# Altium schematic sheet Cover Page.SchDoc: Cover Page
size Letter; Organization: IT Logic; Address1: 5753 Highway 85 N; Address2: Crestview, FL 32536; Address3: United States; DocumentNumber: 1; SheetNumber: 1; SheetTotal: 6; Email: pcb-design@itlogic.cloud
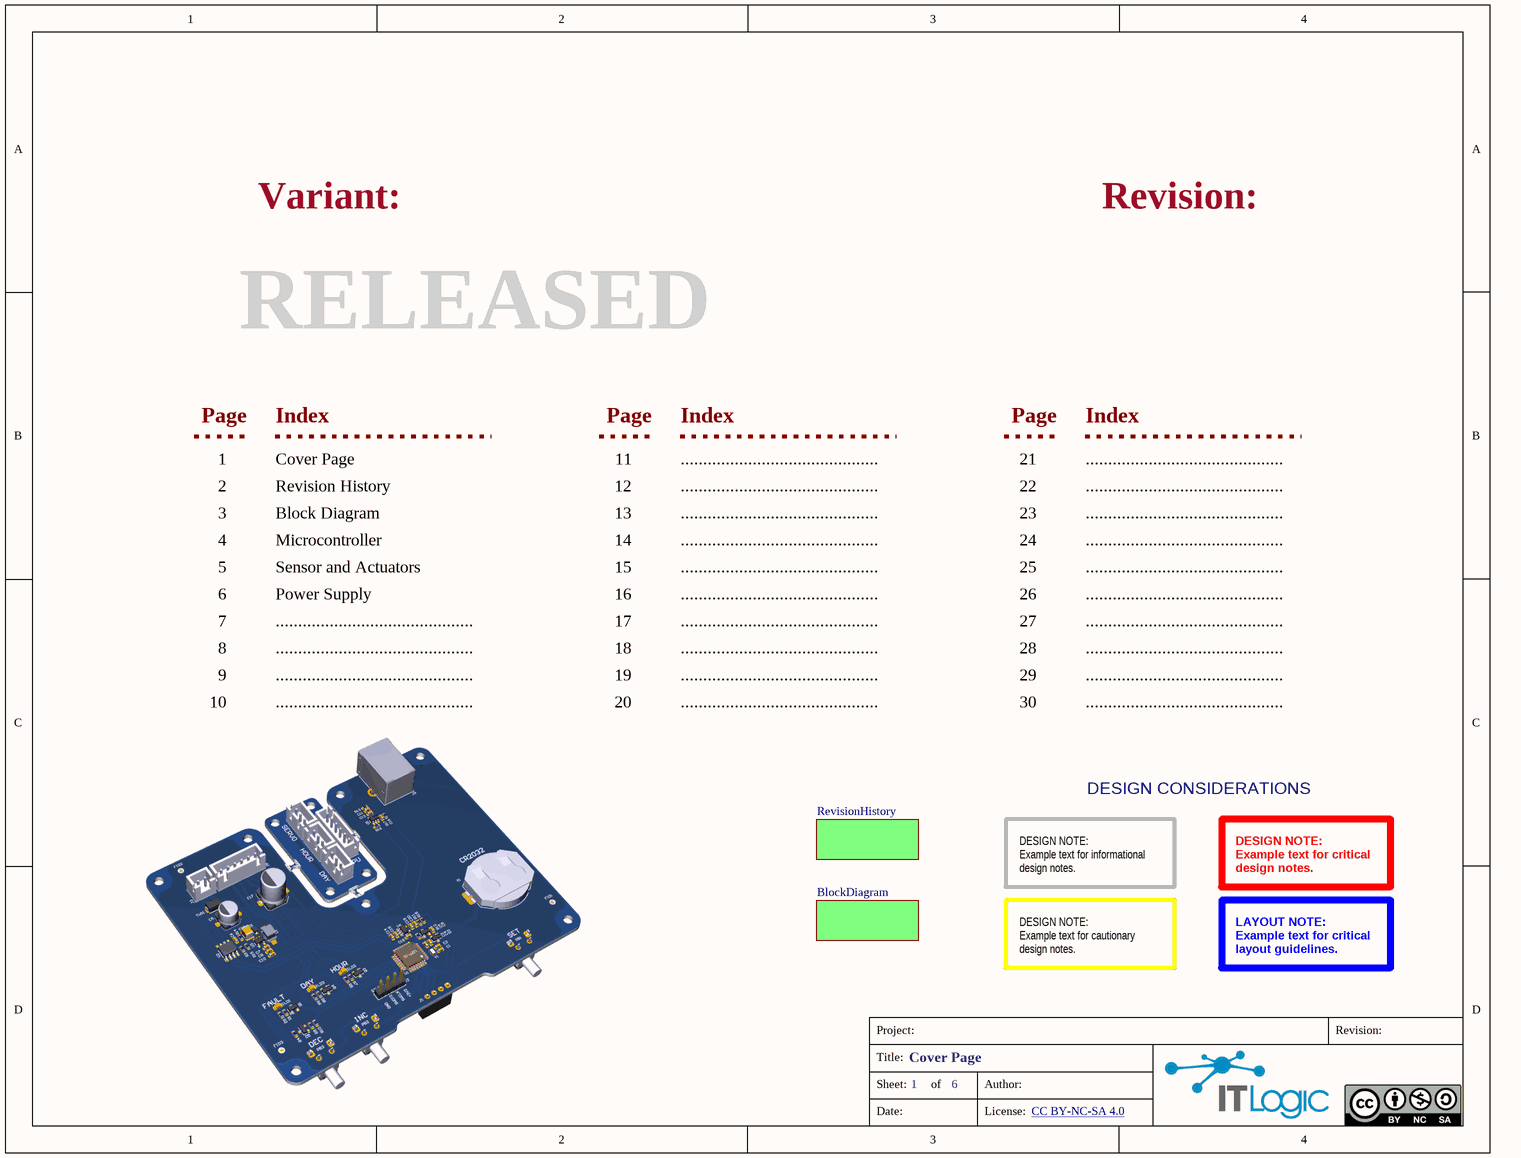
[diagram p0: Cover Page.SchDoc]

## Sub-sheets
BlockDiagram = Block Diagram.SchDoc: no entries
RevisionHistory = Revision History.SchDoc: no entries

## Notes on the sheet
- Variant:
- Revision:
- RELEASED
- Page
- Index
- 1
- 2
- Cover Page
- Revision History
- 11
- 12
- ............................................
- 21
- 22
- 3
- 4
- 5
- Microcontroller
- Sensor and Actuators
- Block Diagram
- 13
- 14
- 15
- 23
- 24
- 25
- 6
- 7
- Power Supply
- 16
- 17
- 26
- 27
- 8
- 9
- 10
- 18
- 19
- 20
- 28
- 29
- 30
- DESIGN CONSIDERATIONS
- DESIGN NOTE:
  Example text for informational
  design notes.
- DESIGN NOTE:
  Example text for critical
  design notes.
- DESIGN NOTE:
  Example text for cautionary
  design notes.
- LAYOUT NOTE:
  Example text for critical
  layout guidelines.
- Project:
- Title:
- Sheet:
- of
- Author:
- Date:
- License:
- CC BY-NC-SA 4.0 <https://creativecommons.org/licenses/by-nc-sa/4.0/>